# Altium project Controller.PrjPCB
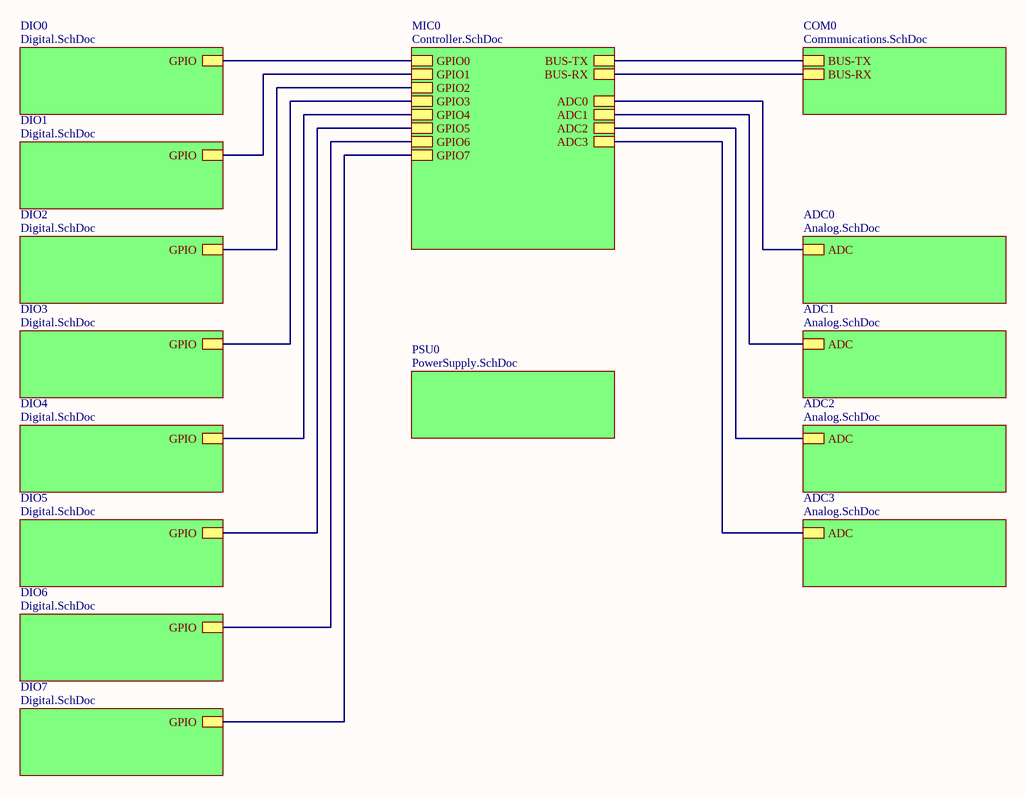
[diagram p0: Main.SchDoc]
6 sheets, 184 parts. Net scope: hierarchical (ports join the sheet entries above them; power ports are global).
Board file: Controller.PcbDoc
Sheets:
  Main.SchDoc
    ADC0 = Analog.SchDoc
    ADC1 = Analog.SchDoc
    COM0 = Communications.SchDoc
    MIC0 = Controller.SchDoc
    PSU0 = PowerSupply.SchDoc
    DIO2 = Digital.SchDoc
    DIO3 = Digital.SchDoc
    DIO4 = Digital.SchDoc
    DIO5 = Digital.SchDoc
    DIO6 = Digital.SchDoc
    DIO7 = Digital.SchDoc
    DIO1 = Digital.SchDoc
    DIO0 = Digital.SchDoc
    ADC2 = Analog.SchDoc
    ADC3 = Analog.SchDoc

## Sheet Main.SchDoc
size A4

### Sub-sheets
ADC0 = Analog.SchDoc: ADC
ADC1 = Analog.SchDoc: ADC
ADC2 = Analog.SchDoc: ADC
ADC3 = Analog.SchDoc: ADC
COM0 = Communications.SchDoc: BUS-TX, BUS-RX
DIO0 = Digital.SchDoc: GPIO
DIO1 = Digital.SchDoc: GPIO
DIO2 = Digital.SchDoc: GPIO
DIO3 = Digital.SchDoc: GPIO
DIO4 = Digital.SchDoc: GPIO
DIO5 = Digital.SchDoc: GPIO
DIO6 = Digital.SchDoc: GPIO
DIO7 = Digital.SchDoc: GPIO
MIC0 = Controller.SchDoc: BUS-TX, BUS-RX, GPIO0, GPIO7, GPIO6, GPIO5, GPIO4, GPIO3, GPIO2, GPIO1, ADC0, ADC1, ADC2, ADC3
PSU0 = PowerSupply.SchDoc: no entries

### Nets
AIN0: sheet ADC0/ADC, sheet MIC0/ADC0
AIN1: sheet ADC1/ADC, sheet MIC0/ADC1
AIN2: sheet MIC0/ADC2, sheet ADC2/ADC
AIN3: sheet MIC0/ADC3, sheet ADC3/ADC
BUS-RX: sheet COM0/BUS-RX, sheet MIC0/BUS-RX
BUS-TX: sheet COM0/BUS-TX, sheet MIC0/BUS-TX
DIO0: sheet MIC0/GPIO0, sheet DIO0/GPIO
DIO1: sheet MIC0/GPIO1, sheet DIO1/GPIO
DIO2: sheet MIC0/GPIO2, sheet DIO2/GPIO
DIO3: sheet MIC0/GPIO3, sheet DIO3/GPIO
DIO4: sheet MIC0/GPIO4, sheet DIO4/GPIO
DIO5: sheet MIC0/GPIO5, sheet DIO5/GPIO
DIO6: sheet MIC0/GPIO6, sheet DIO6/GPIO
DIO7: sheet MIC0/GPIO7, sheet DIO7/GPIO

## Sheet Analog.SchDoc
size A4
Used 4 times, as channels ADC0, ADC1, ADC2, ADC3. Parts and nets are listed once, with the designators drawn on the sheet.
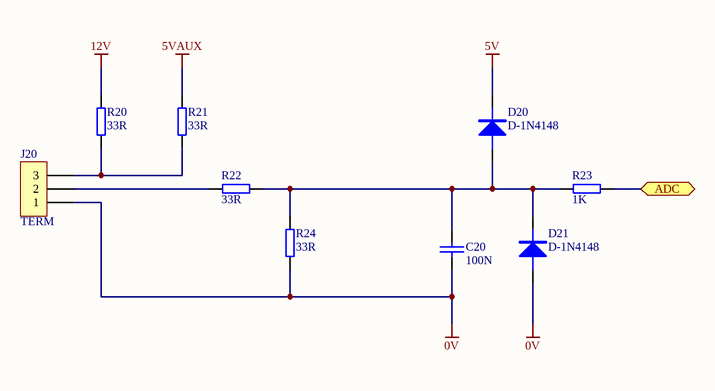
[diagram p1: Analog.SchDoc]

### Parts
C20  100N  [AXIAL02]
D20  D-1N4148  [DO35S]
D21  D-1N4148  [DO35S]
J20  TERM  [MKD500S3]
R20  33R  [AXIAL04]
R21  33R  [AXIAL04]
R22  33R  [AXIAL04]
R23  1K  [AXIAL04]
R24  33R  [AXIAL04]

### Ports
ADC

### Nets
0V: C20.2 D21.1(A) J20.1 R24.1
5V: D20.2(K)
5VAUX: R21.2
12V: R20.2
ADC: R23.2 ; port ADC
NetC20_1: C20.1 D20.1(A) D21.2(K) R22.1 R23.1 R24.2
NetJ20_2: J20.2 R22.2
NetJ20_3: J20.3 R20.1 R21.1

### Channels
ADC0: designators end in _A0; ports ADC=AIN0
ADC1: designators end in _A1; ports ADC=AIN1
ADC2: designators end in _A2; ports ADC=AIN2
ADC3: designators end in _A3; ports ADC=AIN3

### Library data of the parts
C20 = C-B100N: CAPACITOR
D20 D21 = D-1N4148: 1N4148
J20 = J-SCR-3: CONNECTOR
R20-R22 R24 = R-A33R: RESISTOR; Detail: *; Order: *; Cost: *
R23 = R-A1K: RESISTOR; Detail: *; Order: *; Cost: *

## Sheet Communications.SchDoc
size A4
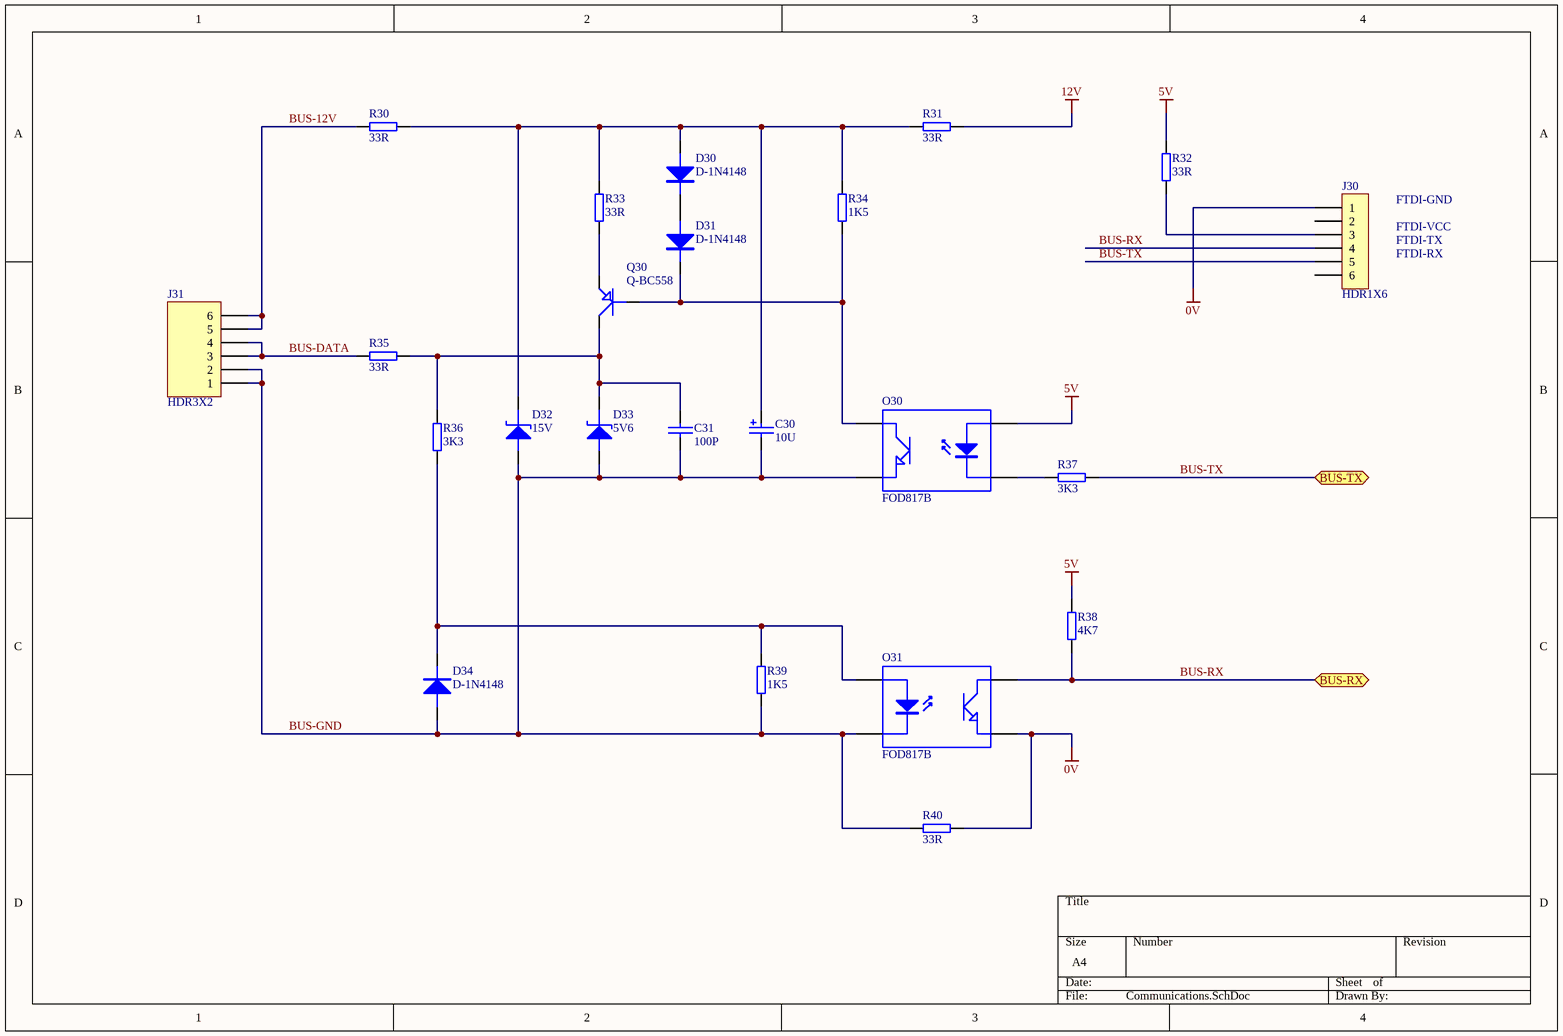
[diagram p2: Communications.SchDoc]

### Parts
C30  10U  [RADIAL02P]
C31  100P  [AXIAL02]
D30  D-1N4148  [DO35S]
D31  D-1N4148  [DO35S]
D32  15V  [DO35S]
D33  5V6  [DO35S]
D34  D-1N4148  [DO35S]
J30  HDR1X6  [HDR6X1]
J31  HDR3X2  [HDR3X2]
O30  FOD817B  [DIP4]
O31  FOD817B  [DIP4]
Q30  Q-BC558  [TO92]
R30  33R  [AXIAL04]
R31  33R  [AXIAL04]
R32  33R  [AXIAL04]
R33  33R  [AXIAL04]
R34  1K5  [AXIAL04]
R35  33R  [AXIAL04]
R36  3K3  [AXIAL04]
R37  3K3  [AXIAL04]
R38  4K7  [AXIAL04]
R39  1K5  [AXIAL04]
R40  33R  [AXIAL04]

### Ports
BUS-RX, BUS-TX

### Nets
0V: J30.1 O31.3(E) R40.2
5V: O30.1(A) R32.2 R38.2
12V: R31.2
BUS-12V: J31.5 J31.6 R30.1
BUS-DATA: J31.3 J31.4 R35.1
BUS-GND: C30.2 C31.2 D32.1(A) D33.1(A) D34.1(A) J31.1 J31.2 O30.3(E) O31.2(K) R39.1 R40.1
BUS-RX: J30.4 O31.4(C) R38.1 ; port BUS-RX
BUS-TX: J30.5 R37.1 ; port BUS-TX
NetC30_1: C30.1 D30.1(A) D32.2(K) R30.2 R31.1 R33.2 R34.2
NetC31_1: C31.1 D33.2(K) Q30.3(C) R35.2 R36.2
NetD30_2: D30.2(K) D31.1(A)
NetD31_2: D31.2(K) O30.4(C) Q30.2(B) R34.1
NetD34_2: D34.2(K) O31.1(A) R36.1 R39.2
NetJ30_3: J30.3 R32.1
NetO30_2: O30.2(K) R37.2
NetQ30_1: Q30.1(E) R33.1

Not connected (* = marked no-connect by the designer): J30 2 6

### Notes on the sheet
- FTDI-TX
- FTDI-GND
- FTDI-VCC
- FTDI-RX

### Library data of the parts
C30 = C-A10U: CAP
C31 = C-B100P: CAPACITOR
D30 D31 D34 = D-1N4148: 1N4148
D32 = D-BZX79-15: ZENER DIODE
D33 = D-BZX79-5V6: ZENER DIODE
J30 = J-HDR1X6: CONNECTOR; Text Field1: 6 PIN 2.54MM PITCH SINGLE
J31 = J-HDR3X2A: CONNECTOR
O30 O31 = O-FOD817B: OPTO ISOLATOR
Q30 = Q-BC558: BC558
R30-R33 R35 R40 = R-A33R: RESISTOR; Detail: *; Order: *; Cost: *
R34 R39 = R-A1K5: RESISTOR; Detail: *; Order: *; Cost: *
R36 R37 = R-A3K3: RESISTOR; Detail: *; Order: *; Cost: *
R38 = R-A4K7: RESISTOR; Detail: *; Order: *; Cost: *

## Sheet Controller.SchDoc
size A4
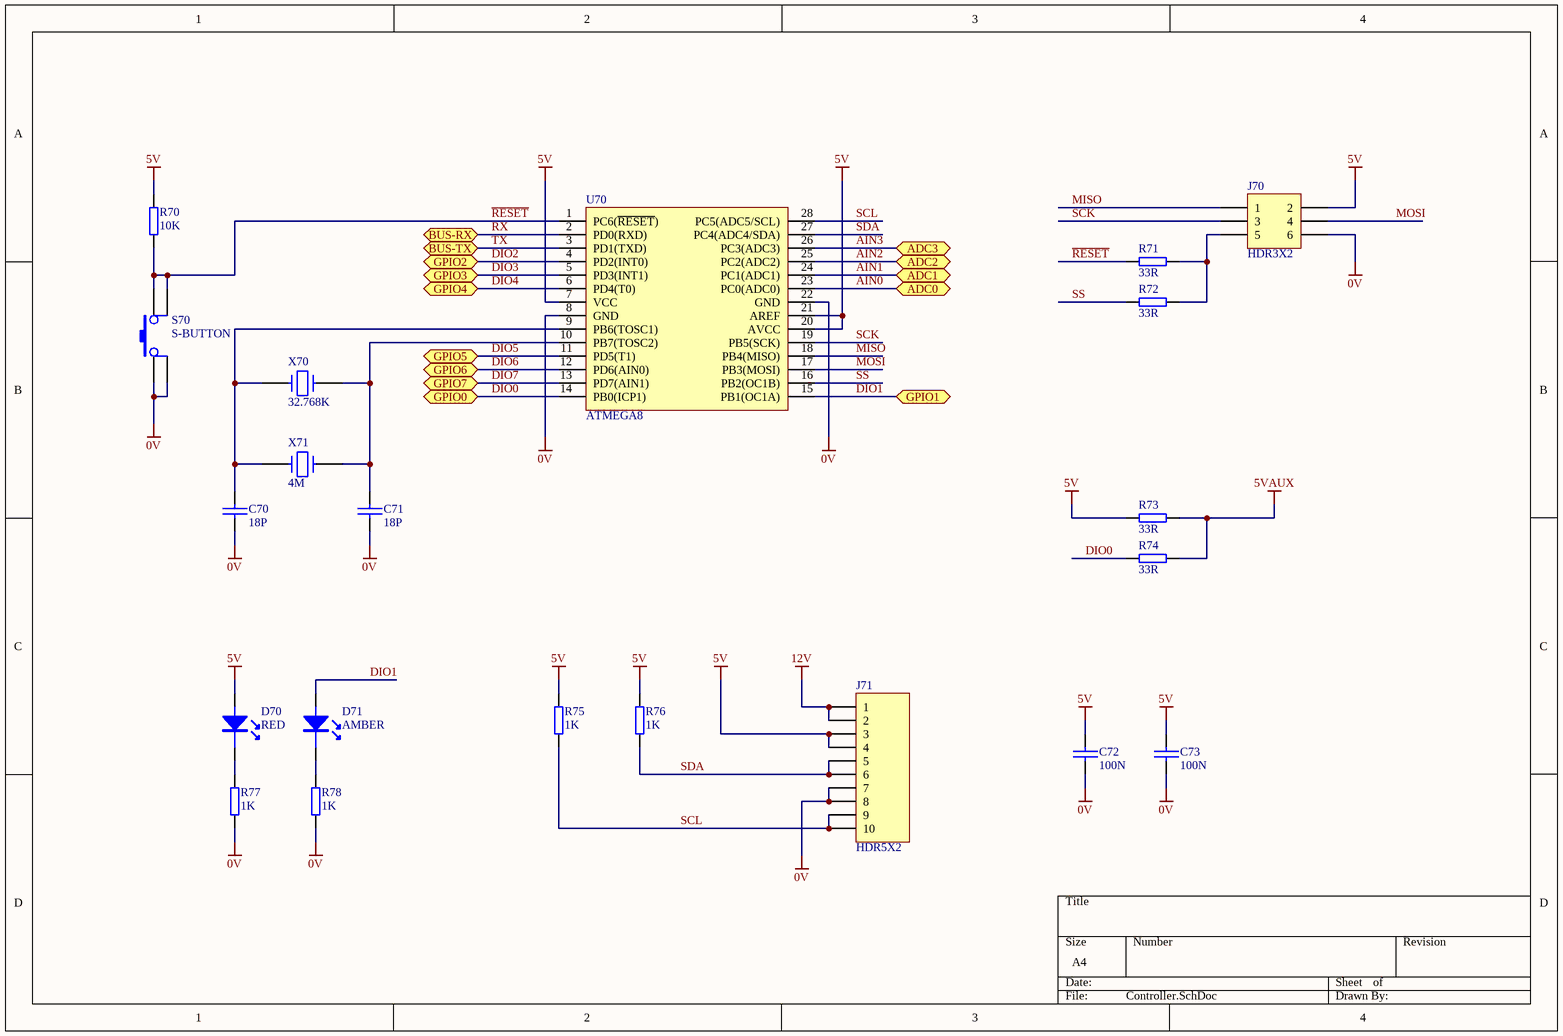
[diagram p3: Controller.SchDoc]

### Parts
C70  18P  [AXIAL02]
C71  18P  [AXIAL02]
C72  100N  [AXIAL02]
C73  100N  [AXIAL02]
D70  RED  [LED5MM]
D71  AMBER  [LED5MM]
J70  HDR3X2  [HDR3X2]
J71  HDR5X2  [HDR5X2]
R70  10K  [AXIAL04]
R71  33R  [AXIAL04]
R72  33R  [AXIAL04]
R73  33R  [AXIAL04]
R74  33R  [AXIAL04]
R75  1K  [AXIAL04]
R76  1K  [AXIAL04]
R77  1K  [AXIAL04]
R78  1K  [AXIAL04]
S70  S-BUTTON  [SWPB]
U70  ATMEGA8  [DIP28N]
X70  32.768K  [RADIAL01]
X71  4M  [HC49]

### Ports
ADC0, ADC1, ADC2, ADC3, BUS-RX, BUS-TX, GPIO0, GPIO1, GPIO2, GPIO3, GPIO4, GPIO5, GPIO6, GPIO7

### Nets
0V: C70.2 C71.2 C72.2 C73.2 J70.6 J71.7 J71.8 R77.1 R78.1 S70.1 S70.3 U70.8(GND) U70.22(GND)
5V: C72.1 C73.1 D70.1(A) J70.2 J71.3 J71.4 R70.2 R73.2 R75.2 R76.2 U70.7(VCC) U70.20(AVCC) U70.21(AREF)
5VAUX: R73.1 R74.1
12V: J71.1 J71.2
AIN0: U70.23(PC0(ADC0)) ; port ADC0
AIN1: U70.24(PC1(ADC1)) ; port ADC1
AIN2: U70.25(PC2(ADC2)) ; port ADC2
AIN3: U70.26(PC3(ADC3)) ; port ADC3
DIO0: R74.2 U70.14(PB0(ICP1)) ; port GPIO0
DIO1: D71.1(A) U70.15(PB1(OC1A)) ; port GPIO1
DIO2: U70.4(PD2(INT0)) ; port GPIO2
DIO3: U70.5(PD3(INT1)) ; port GPIO3
DIO4: U70.6(PD4(T0)) ; port GPIO4
DIO5: U70.11(PD5(T1)) ; port GPIO5
DIO6: U70.12(PD6(AIN0)) ; port GPIO6
DIO7: U70.13(PD7(AIN1)) ; port GPIO7
MISO: J70.1 U70.18(PB4(MISO))
MOSI: J70.4 U70.17(PB3(MOSI))
~{RESET}: R70.1 R71.1 S70.2 S70.4 U70.1(PC6(~{RESET}))
RX: U70.2(PD0(RXD)) ; port BUS-RX  [project net BUS-RX]
SCK: J70.3 U70.19(PB5(SCK))
SCL: J71.9 J71.10 R75.1 U70.28(PC5(ADC5/SCL))
SDA: J71.5 J71.6 R76.1 U70.27(PC4(ADC4/SDA))
SS: R72.1 U70.16(PB2(OC1B))
TX: U70.3(PD1(TXD)) ; port BUS-TX  [project net BUS-TX]
NetC70_1: C70.1 U70.9(PB6(TOSC1)) X70.1 X71.1
NetC71_1: C71.1 U70.10(PB7(TOSC2)) X70.2 X71.2
NetD70_2: D70.2(K) R77.2
NetD71_2: D71.2(K) R78.2
NetJ70_5: J70.5 R71.2 R72.2

### Library data of the parts
C70 C71 = C-B18P: CAPACITOR
C72 C73 = C-B100N: CAPACITOR
D70 = O-RED: LED
D71 = O-AMBER: LED
J70 = J-HDR3X2: CONNECTOR
J71 = J-HDR5X2A: CONNECTOR
R70 = R-A10K: RESISTOR; Detail: *; Order: *; Cost: *
R71-R74 = R-A33R: RESISTOR; Detail: *; Order: *; Cost: *
R75-R78 = R-A1K: RESISTOR; Detail: *; Order: *; Cost: *
S70 = S-BUTTON: PUSH BUTTON SWITCH
U70 = U-ATMEGA8: MICROCONTROLLER
X70 = X-32K768: CRYSTAL
X71 = X-4M: CRYSTAL

## Sheet PowerSupply.SchDoc
size A4
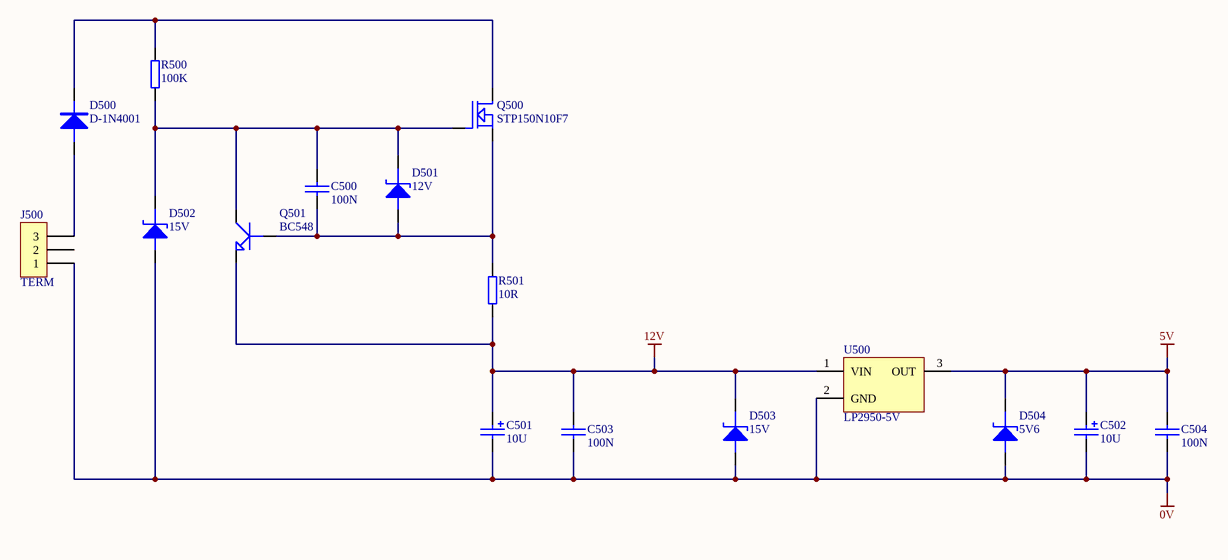
[diagram p4: PowerSupply.SchDoc]

### Parts
C500  100N  [AXIAL02]
C501  10U  [RADIAL02P]
C502  10U  [RADIAL02P]
C503  100N  [AXIAL02]
C504  100N  [AXIAL02]
D500  D-1N4001  [DO35S]
D501  12V  [DO35S]
D502  15V  [DO35S]
D503  15V  [DO35S]
D504  5V6  [DO35S]
J500  TERM  [MKD500S3]
Q500  STP150N10F7  [TO220FS]
Q501  BC548  [TO92]
R500  100K  [AXIAL04]
R501  10R  [AXIAL04]
U500  LP2950-5V  [TO92]

### Nets
0V: C501.2 C502.2 C503.2 C504.2 D502.1(A) D503.1(A) D504.1(A) J500.1 U500.2(GND)
5V: C502.1 C504.1 D504.2(K) U500.3(OUT)
12V: C501.1 C503.1 D503.2(K) Q501.1(E) R501.1 U500.1(VIN)
NetC500_1: C500.1 D501.2(K) D502.2(K) Q500.1(G) Q501.3(C) R500.1
NetC500_2: C500.2 D501.1(A) Q500.3(S) Q501.2(B) R501.2
NetD500_1: D500.1(A) J500.3
NetD500_2: D500.2(K) Q500.2(D) R500.2

Not connected (* = marked no-connect by the designer): J500 2

### Library data of the parts
C500 C503 C504 = C-B100N: CAPACITOR
C501 C502 = C-A10U: CAP
D500 = D-1N4001: 1N4001
D501 = D-BZX79-12: ZENER DIODE
D502 D503 = D-BZX79-15: ZENER DIODE
D504 = D-BZX79-5V6: ZENER DIODE
J500 = J-SCR-3: CONNECTOR
Q500 = Q-STP150N10F7: MOSFET
Q501 = Q-BC548
R500 = R-A100K: RESISTOR; Detail: *; Order: *; Cost: *
R501 = R-A10R: RESISTOR; Detail: *; Order: *; Cost: *
U500 = U-LP2950: LP2950

## Sheet Digital.SchDoc
size A4
Used 8 times, as channels DIO2, DIO3, DIO4, DIO5, DIO6, DIO7, DIO1, DIO0. Parts and nets are listed once, with the designators drawn on the sheet.
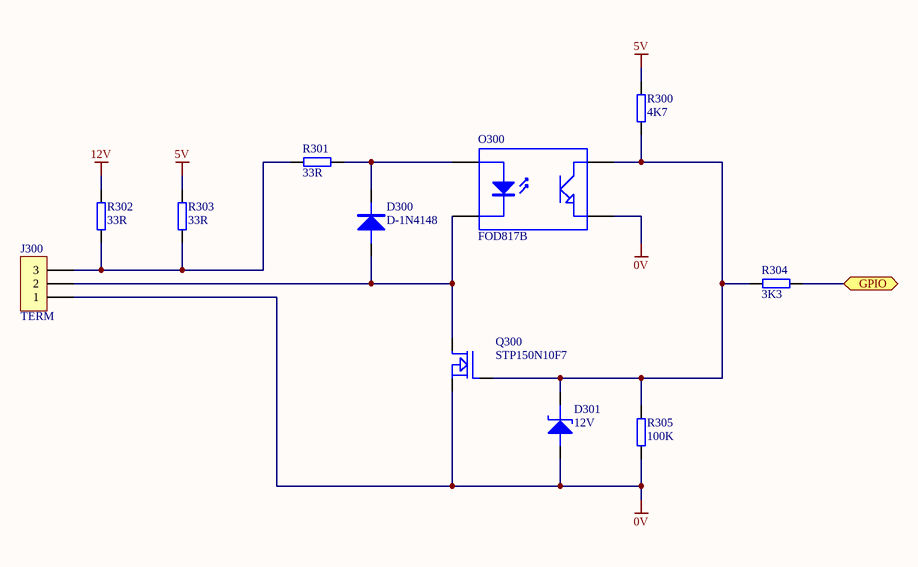
[diagram p5: Digital.SchDoc]

### Parts
D300  D-1N4148  [DO35S]
D301  12V  [DO35S]
J300  TERM  [MKD500S3]
O300  FOD817B  [DIP4]
Q300  STP150N10F7  [TO220FS]
R300  4K7  [AXIAL04]
R301  33R  [AXIAL04]
R302  33R  [AXIAL04]
R303  33R  [AXIAL04]
R304  3K3  [AXIAL04]
R305  100K  [AXIAL04]

### Ports
GPIO

### Nets
0V: D301.1(A) J300.1 O300.3(E) Q300.3(S) R305.1
5V: R300.2 R303.2
12V: R302.2
GPIO: R304.2 ; port GPIO
NetD300_1: D300.1(A) J300.2 O300.2(K) Q300.2(D)
NetD300_2: D300.2(K) O300.1(A) R301.1
NetD301_2: D301.2(K) O300.4(C) Q300.1(G) R300.1 R304.1 R305.2
NetJ300_3: J300.3 R301.2 R302.1 R303.1

### Channels
DIO2: designators D300=D10_D2 D301=D11_D2 J300=J10_D2 O300=O10_D2 Q300=Q300_DIO2 R300=R10_D2 R301=R11_D2 R302=R12_D2 R303=R13_D2 R304=R14_D2 R305=R15_D2; ports GPIO=DIO2
DIO3: designators D300=D10_D3 D301=D11_D3 J300=J10_D3 O300=O10_D3 Q300=Q300_DIO3 R300=R10_D3 R301=R11_D3 R302=R12_D3 R303=R13_D3 R304=R14_D3 R305=R15_D3; ports GPIO=DIO3
DIO4: designators D300=D10_D4 D301=D11_D4 J300=J10_D4 O300=O10_D4 Q300=Q300_DIO4 R300=R10_D4 R301=R11_D4 R302=R12_D4 R303=R13_D4 R304=R14_D4 R305=R15_D4; ports GPIO=DIO4
DIO5: designators D300=D10_D5 D301=D11_D5 J300=J10_D5 O300=O10_D5 Q300=Q300_DIO5 R300=R10_D5 R301=R11_D5 R302=R12_D5 R303=R13_D5 R304=R14_D5 R305=R15_D5; ports GPIO=DIO5
DIO6: designators D300=D10_D6 D301=D11_D6 J300=J10_D6 O300=O10_D6 Q300=Q300_DIO6 R300=R10_D6 R301=R11_D6 R302=R12_D6 R303=R13_D6 R304=R14_D6 R305=R15_D6; ports GPIO=DIO6
DIO7: designators D300=D10_D7 D301=D11_D7 J300=J10_D7 O300=O10_D7 Q300=Q300_DIO7 R300=R10_D7 R301=R11_D7 R302=R12_D7 R303=R13_D7 R304=R14_D7 R305=R15_D7; ports GPIO=DIO7
DIO1: designators D300=D10_D1 D301=D11_D1 J300=J10_D1 O300=O10_D1 Q300=Q300_DIO1 R300=R10_D1 R301=R11_D1 R302=R12_D1 R303=R13_D1 R304=R14_D1 R305=R15_D1; ports GPIO=DIO1
DIO0: designators D300=D10_D0 D301=D11_D0 J300=J10_D0 O300=O10_D0 Q300=Q300_DIO0 R300=R10_D0 R301=R11_D0 R302=R12_D0 R303=R13_D0 R304=R14_D0 R305=R15_D0; ports GPIO=DIO0

### Library data of the parts
D300 = D-1N4148: 1N4148
D301 = D-BZX79-12: ZENER DIODE
J300 = J-SCR-3: CONNECTOR
O300 = O-FOD817B: OPTO ISOLATOR
Q300 = Q-STP150N10F7: MOSFET
R300 = R-A4K7: RESISTOR; Detail: *; Order: *; Cost: *
R301-R303 = R-A33R: RESISTOR; Detail: *; Order: *; Cost: *
R304 = R-A3K3: RESISTOR; Detail: *; Order: *; Cost: *
R305 = R-A100K: RESISTOR; Detail: *; Order: *; Cost: *

## Nets that join several sheets
0V: ADC0 (C20_A0.2 D21_A0.1 J20_A0.1 R24_A0.1), ADC1 (C20_A1.2 D21_A1.1 J20_A1.1 R24_A1.1), Communications (J30.1 O31.3 R40.2), Controller (13 pins), PowerSupply (9 pins), DIO2 (5 pins), DIO3 (5 pins), DIO4 (5 pins), DIO5 (5 pins), DIO6 (5 pins), DIO7 (5 pins), DIO1 (5 pins), DIO0 (5 pins), ADC2 (C20_A2.2 D21_A2.1 J20_A2.1 R24_A2.1), ADC3 (C20_A3.2 D21_A3.1 J20_A3.1 R24_A3.1)
5V: ADC0 (D20_A0.2), ADC1 (D20_A1.2), Communications (O30.1 R32.2 R38.2), Controller (13 pins), PowerSupply (C502.1 C504.1 D504.2 U500.3), DIO2 (R10_D2.2 R13_D2.2), DIO3 (R10_D3.2 R13_D3.2), DIO4 (R10_D4.2 R13_D4.2), DIO5 (R10_D5.2 R13_D5.2), DIO6 (R10_D6.2 R13_D6.2), DIO7 (R10_D7.2 R13_D7.2), DIO1 (R10_D1.2 R13_D1.2), DIO0 (R10_D0.2 R13_D0.2), ADC2 (D20_A2.2), ADC3 (D20_A3.2)
5VAUX: ADC0 (R21_A0.2), ADC1 (R21_A1.2), Controller (R73.1 R74.1), ADC2 (R21_A2.2), ADC3 (R21_A3.2)
12V: ADC0 (R20_A0.2), ADC1 (R20_A1.2), Communications (R31.2), Controller (J71.1 J71.2), PowerSupply (6 pins), DIO2 (R12_D2.2), DIO3 (R12_D3.2), DIO4 (R12_D4.2), DIO5 (R12_D5.2), DIO6 (R12_D6.2), DIO7 (R12_D7.2), DIO1 (R12_D1.2), DIO0 (R12_D0.2), ADC2 (R20_A2.2), ADC3 (R20_A3.2)
AIN0: ADC0 (R23_A0.2), Controller (U70.23)
AIN1: ADC1 (R23_A1.2), Controller (U70.24)
AIN2: Controller (U70.25), ADC2 (R23_A2.2)
AIN3: Controller (U70.26), ADC3 (R23_A3.2)
BUS-RX: Communications (J30.4 O31.4 R38.1), Controller (U70.2)
BUS-TX: Communications (J30.5 R37.1), Controller (U70.3)
DIO0: Controller (R74.2 U70.14), DIO0 (R14_D0.2)
DIO1: Controller (D71.1 U70.15), DIO1 (R14_D1.2)
DIO2: Controller (U70.4), DIO2 (R14_D2.2)
DIO3: Controller (U70.5), DIO3 (R14_D3.2)
DIO4: Controller (U70.6), DIO4 (R14_D4.2)
DIO5: Controller (U70.11), DIO5 (R14_D5.2)
DIO6: Controller (U70.12), DIO6 (R14_D6.2)
DIO7: Controller (U70.13), DIO7 (R14_D7.2)